# EAGLE schematic nav10_mxp_3_3_final_expio (EAGLE 6.5.0)
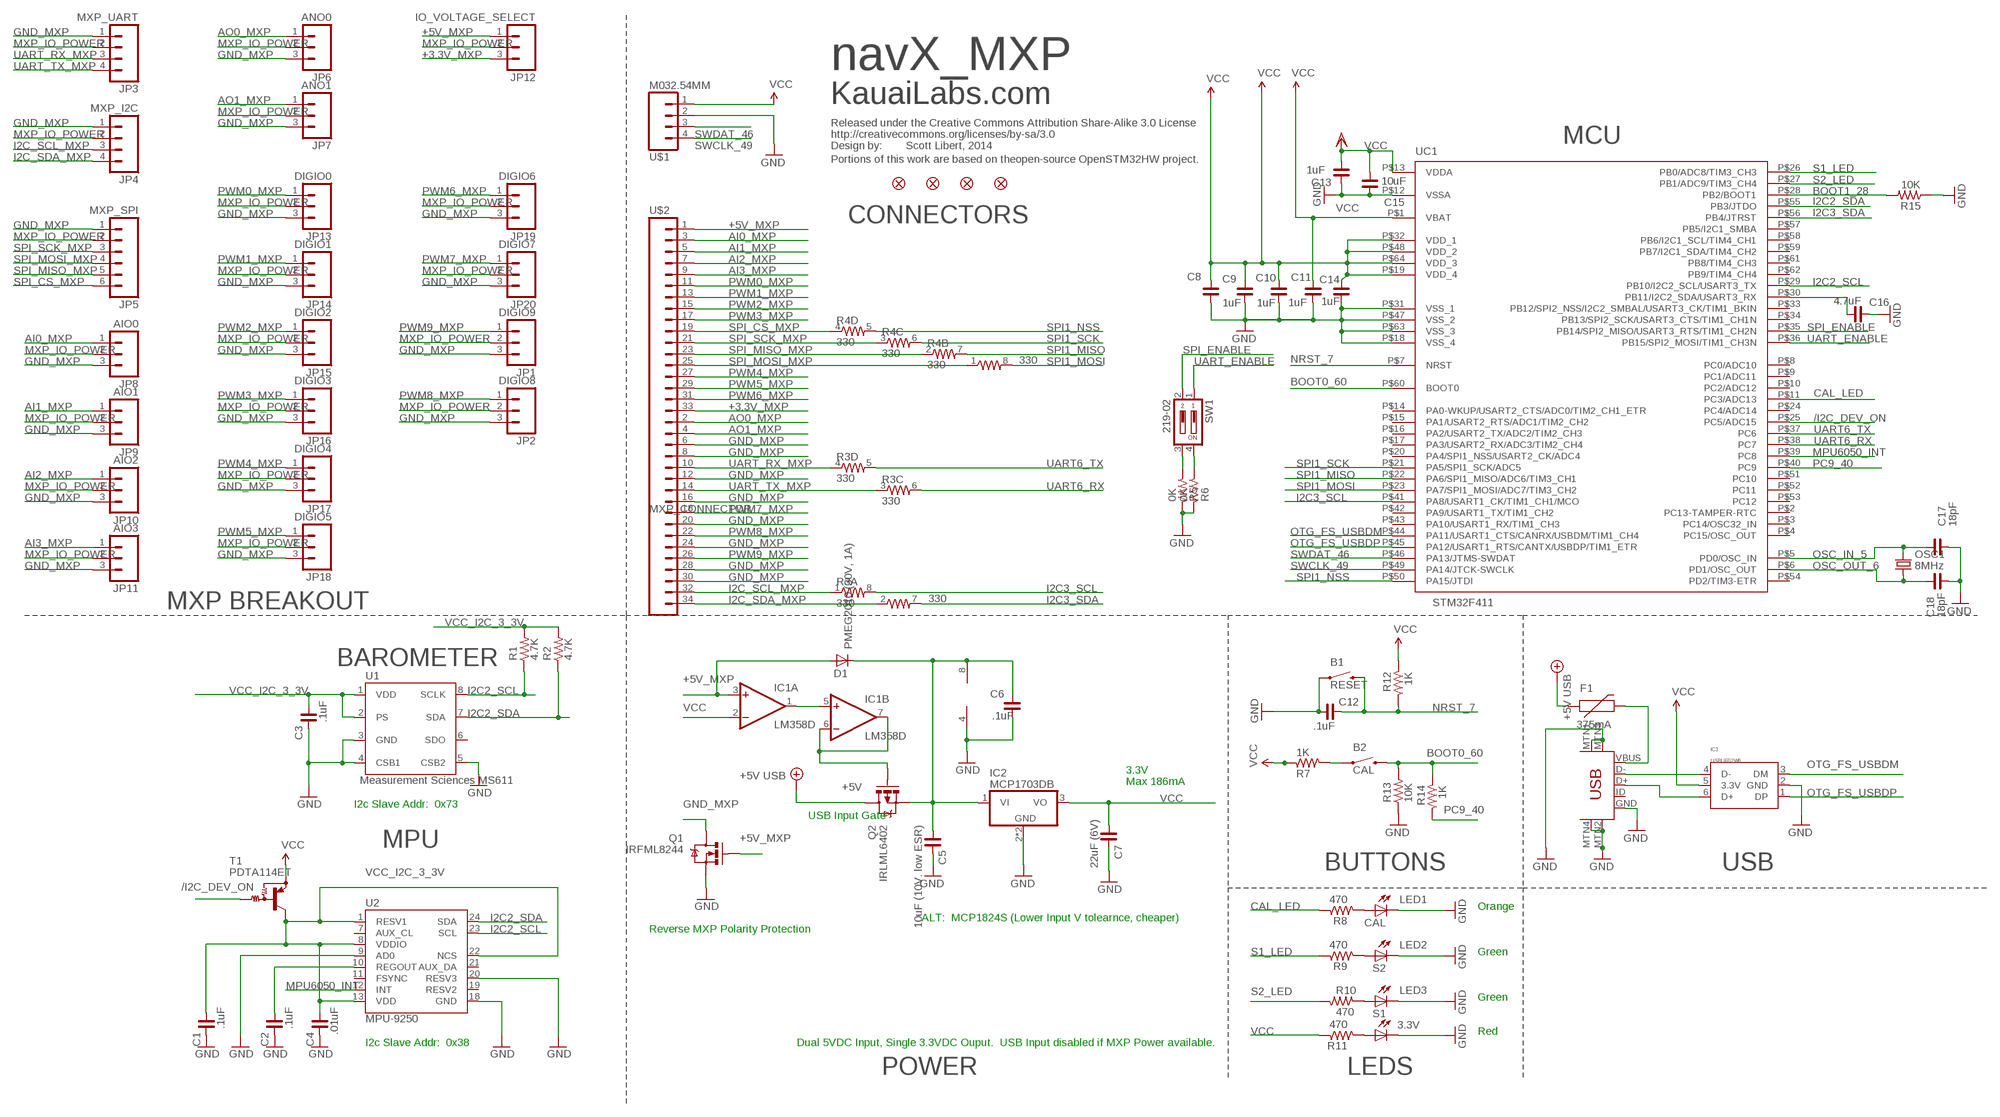
[diagram p0: schematic, sheet 1]

## Parts
B1  RESET  SWITCH-MOMENTARY-2-SMD-1101NE  [TACTILE-SWITCH-1101NE]
B2  CAL  SWITCH-MOMENTARY-2-SMD-1101NE  [TACTILE-SWITCH-1101NE]
C1  .1uF  C_0603  [C0603]
C2  .1uF  C_0603  [C0603]
C3  .1uF  C_0603  [C0603]
C4  .01uF  C_0603  [C0603]
C5  10uF (10V. low ESR)  C_0805  [C0805]
C6  .1uF  C_0603  [C0603]
C7  22uF (6V)  C_0805  [C0805]
C8  1uF  C_0603  [C0603]
C9  1uF  C_0603  [C0603]
C10  1uF  C_0603  [C0603]
C11  1uF  C_0603  [C0603]
C12  .1uF  C_0603  [C0603]
C13  1uF  C_0603  [C0603]
C14  1uF  C_0603  [C0603]
C15  10uF  C_0805  [C0805]
C16  4.7uF  C_0603  [C0603]
C17  18pF  C_0603  [C0603]
C18  18pF  C_0603  [C0603]
D1  PMEG2010 (30V, 1A)  DIODESOD-323  [SOD-323]
F1  375mA  PTC0603  [0603]
IC1  LM358D  [SO08]
IC2  MCP1703DB  [MCP1703DB]
IC3  USBUF02W6  [SC70-6]
JP1  DIGIO9  M03PTH  [1X03]
JP2  DIGIO8  M03PTH  [1X03]
JP3  MXP_UART  M04PTH  [1X04]
JP4  MXP_I2C  M04PTH  [1X04]
JP5  MXP_SPI  M06SIP  [1X06]
JP6  ANO0  M03PTH  [1X03]
JP7  ANO1  M03PTH  [1X03]
JP8  AIO0  M03PTH  [1X03]
JP9  AIO1  M03PTH  [1X03]
JP10  AIO2  M03PTH  [1X03]
JP11  AIO3  M03PTH  [1X03]
JP12  IO_VOLTAGE_SELECT  M03PTH  [1X03]
JP13  DIGIO0  M03PTH  [1X03]
JP14  DIGIO1  M03PTH  [1X03]
JP15  DIGIO2  M03PTH  [1X03]
JP16  DIGIO3  M03PTH  [1X03]
JP17  DIGIO4  M03PTH  [1X03]
JP18  DIGIO5  M03PTH  [1X03]
JP19  DIGIO6  M03PTH  [1X03]
JP20  DIGIO7  M03PTH  [1X03]
JP21  FIDUCIAL1X2  [FIDUCIAL-1X2]
JP22  FIDUCIAL1X2  [FIDUCIAL-1X2]
JP23  FIDUCIAL1X2  [FIDUCIAL-1X2]
JP24  FIDUCIAL1X2  [FIDUCIAL-1X2]
LED1  CAL  LEDCHIP-LED0603  [CHIP-LED0603]
LED2  S2  LEDCHIP-LED0603  [CHIP-LED0603]
LED3  S1  LEDCHIP-LED0603  [CHIP-LED0603]
LED4  3.3V  LEDCHIP-LED0603  [CHIP-LED0603]
LICENSE_TEXT  CREATIVE_COMMONS  [CREATIVE_COMMONS]
OSC1  8MHz  CRYSTAL5X3  [CRYSTAL-SMD-5X3]
Q1  IRFML8244  MOSFET-NCHANNELBSS123LT1G  [SOT23]
Q2  IRLML6402  MOSFET-PCHANNELSMD  [SOT23-3]
R1  4.7K  R_0603  [R0603]
R2  4.7K  R_0603  [R0603]
R3  330  RESISTOR-ARRAY0603-ARV  [0603_ARV]
R4  330  RESISTOR-ARRAY0603-ARV  [0603_ARV]
R5  0K  R_0603  [R0603]
R6  0K  R_0603  [R0603]
R7  1K  R_0603  [R0603]
R8  470  R_0603  [R0603]
R9  470  R_0603  [R0603]
R10  470  R_0603  [R0603]
R11  470  R_0603  [R0603]
R12  1K  R_0603  [R0603]
R13  10K  R_0603  [R0603]
R14  1K  R_0603  [R0603]
R15  10K  R_0603  [R0603]
SW1  219-02  [CTS-219-02]
T1  PDTA114ET  PNP-DRIVERSOT23-3  [SOT23-3]
U1  Measurement Sciences MS611  MS5611  [MS5611]
U2  MPU-9250  [QFN24_3MM_INVENSENSE]
U$1  M032.54MM  M041X04_NO_SILK  [1X04_NO_SILK]
U$2  MXP_CONNECTOR  [2X17]
UC1  STM32F411  STM32F103  [TQFP-10X10-64]
USB  Mini-USB  USB-MINIB-5PIN  [USB-MINIB]

## Nets
+3.3V_MXP: JP12.3 U$2.33(+3.3V)
+5V [vcc]: F1.1 Q2.3(D) ; supply symbol labelled +5V USB
+5V_MXP: D1.A IC1.3(A:+IN) JP12.1 Q1.1(G) U$2.1(+5V)
/I2C_DEV_ON: T1.1(B) UC1.P$25(PC5/ADC15)
AI0_MXP: JP8.1 U$2.3(AI0)
AI1_MXP: JP9.1 U$2.5(AI1)
AI2_MXP: JP10.1 U$2.7(AI2)
AI3_MXP: JP11.1 U$2.9(AI3)
AO0_MXP: JP6.1 U$2.2(AO0)
AO1_MXP: JP7.1 U$2.4(AO1)
BOOT0_60: B2.P$2 R13.2 R14.1 UC1.P$60(BOOT0)
BOOT1_28: R15.2 UC1.P$28(PB2/BOOT1)
CAL_LED: R8.1 UC1.P$11(PC3/ADC13)
GND: B1.P$1 C1.2 C2.2 C3.2 C4.2 C5.2 C6.1 C7.2 C8.1 C9.1 C10.1 C11.1 C12.1 C13.1 C14.1 C15.2 C16.1 C17.1 C18.1 IC1.4(P:V-) IC2.2(GND) IC2.4(GND) IC3.2(GND) LED1.C LED2.C LED3.C LED4.C Q1.2(S) R5.1 R6.1 R13.1 R15.1 U1.3(GND) U1.4(CSB1) U1.5(CSB2) U2.9(AD0) U2.18(GND) U2.20(RESV3) U$1.2 UC1.P$12(VSSA) UC1.P$18(VSS_4) UC1.P$31(VSS_1) UC1.P$47(VSS_2) UC1.P$63(VSS_3) USB.GND USB.MTN1(MTN2) USB.MTN2(MTN3) USB.MTN3(MTN1) USB.MTN4
GND_MXP: JP1.3 JP2.3 JP3.1 JP4.1 JP5.1 JP6.3 JP7.3 JP8.3 JP9.3 JP10.3 JP11.3 JP13.3 JP14.3 JP15.3 JP16.3 JP17.3 JP18.3 JP19.3 JP20.3 Q1.3(D) U$2.6(GND1) U$2.8(GND2) U$2.12(GND3) U$2.16(GND4) U$2.20(GND5) U$2.24(GND6) U$2.28(GND7) U$2.30(GND8)
I2C2_SCL: R1.1 U1.8(SCLK) U2.23(SCL) UC1.P$29(PB10/I2C2_SCL/USART3_TX)
I2C2_SDA: R2.1 U1.7(SDA) U2.24(SDA) UC1.P$55(PB3/JTDO)
I2C3_SCL: R3.8 UC1.P$41(PA8/USART1_CK/TIM1_CH1/MCO)
I2C3_SDA: R3.7 UC1.P$56(PB4/JTRST)
I2C_SCL_MXP: JP4.3 R3.1 U$2.32(DIO14/I2C_SCL)
I2C_SDA_MXP: JP4.4 R3.2 U$2.34(DIO15/I2C_SDA)
MPU6050_INT: U2.12(INT) UC1.P$39(PC8)
MXP_IO_POWER: JP1.2 JP2.2 JP3.2 JP4.2 JP5.2 JP6.2 JP7.2 JP8.2 JP9.2 JP10.2 JP11.2 JP12.2 JP13.2 JP14.2 JP15.2 JP16.2 JP17.2 JP18.2 JP19.2 JP20.2
N$1: C2.1 U2.10(REGOUT)
N$2: B2.P$1 R7.2
N$3: LED3.A R10.1
N$4: C16.2 UC1.P$30(PB11/I2C2_SDA/USART3_RX)
N$5: LED2.A R9.2
N$6: R6.2 SW1.4
N$7: C5.1 C6.2 D1.C IC1.8(P:V+) IC2.1(VI) Q2.2(S)
N$8: R5.2 SW1.3
N$9: IC1.1(A:OUT) IC1.5(B:+IN)
N$10: IC1.6(B:-IN) IC1.7(B:OUT) Q2.1(G)
N$11: LED1.A R8.2
N$14: IC3.4(D-) USB.D-
N$17: IC3.6(D+) USB.D+
N$18: LED4.A R11.2
N$54 [vcc]: F1.2 USB.VBUS
NRST_7: B1.P$2 C12.2 R12.2 UC1.P$7(NRST)
OSC_IN_5: C17.2 OSC1.3 UC1.P$5(PD0/OSC_IN)
OSC_OUT_6: C18.2 OSC1.1 UC1.P$6(PD1/OSC_OUT)
OTG_FS_USBDM: IC3.3(DM) UC1.P$44(PA11/USART1_CTS/CANRX/USBDM/TIM1_CH4)
OTG_FS_USBDP: IC3.1(DP) UC1.P$45(PA12/USART1_RTS/CANTX/USBDP/TIM1_ETR)
PC9_40: R14.2 UC1.P$40(PC9)
PWM0_MXP: JP13.1 U$2.11(DIO0/PWM0)
PWM1_MXP: JP14.1 U$2.13(DIO1/PWM1)
PWM2_MXP: JP15.1 U$2.15(DIO2/PWM2)
PWM3_MXP: JP16.1 U$2.17(DIO3/PWM3)
PWM4_MXP: JP17.1 U$2.27(DIO8/PWM4)
PWM5_MXP: JP18.1 U$2.29(DIO9/PWM5)
PWM6_MXP: JP19.1 U$2.31(DIO10/PWM6)
PWM7_MXP: JP20.1 U$2.18(DIO11/PWM11)
PWM8_MXP: JP2.1 U$2.22(DIO12/PWM12)
PWM9_MXP: JP1.1 U$2.26(DIO13/PWM13)
S1_LED: R9.1 UC1.P$26(PB0/ADC8/TIM3_CH3)
S2_LED: R10.2 UC1.P$27(PB1/ADC9/TIM3_CH4)
SPI1_MISO: R4.7 UC1.P$22(PA6/SPI1_MISO/ADC6/TIM3_CH1)
SPI1_MOSI: R4.8 UC1.P$23(PA7/SPI1_MOSI/ADC7/TIM3_CH2)
SPI1_NSS: R4.5 UC1.P$50(PA15/JTDI)
SPI1_SCK: R4.6 UC1.P$21(PA5/SPI1_SCK/ADC5)
SPI_CS_MXP: JP5.6 R4.4 U$2.19(DIO4/SPICS)
SPI_ENABLE: SW1.2 UC1.P$35(PB14/SPI2_MISO/USART3_RTS/TIM1_CH2N)
SPI_MISO_MXP: JP5.5 R4.2 U$2.23(DIO6/SPIMISO)
SPI_MOSI_MXP: JP5.4 R4.1 U$2.25(DIO7/SPIMOSI)
SPI_SCK_MXP: JP5.3 R4.3 U$2.21(DIO5/SPICLK)
SWCLK_49: U$1.4 UC1.P$49(PA14/JTCK-SWCLK)
SWDAT_46: U$1.3 UC1.P$46(PA13/JTMS-SWDAT)
UART6_RX: R3.6 UC1.P$38(PC7)
UART6_TX: R3.5 UC1.P$37(PC6)
UART_ENABLE: SW1.1 UC1.P$36(PB15/SPI2_MOSI/TIM1_CH3N)
UART_RX_MXP: JP3.3 R3.4 U$2.10(UART.RX)
UART_TX_MXP: JP3.4 R3.3 U$2.14(UART.TX)
VCC [vcc]: C7.1 C8.2 C9.2 C10.2 C11.2 C13.2 C14.2 C15.1 IC1.2(A:-IN) IC2.3(VO) IC3.5(3.3V) R7.1 R11.1 R12.1 T1.2(E) U$1.1 UC1.P$1(VBAT) UC1.P$13(VDDA) UC1.P$19(VDD_4) UC1.P$32(VDD_1) UC1.P$48(VDD_2) UC1.P$64(VDD_3) ; supply symbol labelled VDD
VCC_I2C_3_3V [vcc]: C1.1 C3.1 C4.1 R1.2 R2.2 T1.3(C) U1.1(VDD) U1.2(PS) U2.1(RESV1) U2.8(VDDIO) U2.13(VDD) U2.22(NCS)
Unconnected: U1.6(SDO) U2.7(AUX_CL) U2.11(FSYNC) U2.19(RESV2) U2.21(AUX_DA) UC1.P$2(PC13-TAMPER-RTC) UC1.P$3(PC14/OSC32_IN) UC1.P$4(PC15/OSC_OUT) UC1.P$8(PC0/ADC10) UC1.P$9(PC1/ADC11) UC1.P$10(PC2/ADC12) UC1.P$14(PA0-WKUP/USART2_CTS/ADC0/TIM2_CH1_ETR) UC1.P$15(PA1/USART2_RTS/ADC1/TIM2_CH2) UC1.P$16(PA2/USART2_TX/ADC2/TIM2_CH3) UC1.P$17(PA3/USART2_RX/ADC3/TIM2_CH4) UC1.P$20(PA4/SPI1_NSS/USART2_CK/ADC4) UC1.P$24(PC4/ADC14) UC1.P$33(PB12/SPI2_NSS/I2C2_SMBAL/USART3_CK/TIM1_BKIN) UC1.P$34(PB13/SPI2_SCK/USART3_CTS/TIM1_CH1N) UC1.P$42(PA9/USART1_TX/TIM1_CH2) UC1.P$43(PA10/USART1_RX/TIM1_CH3) UC1.P$51(PC10) UC1.P$52(PC11) UC1.P$53(PC12) UC1.P$54(PD2/TIM3-ETR) UC1.P$57(PB5/I2C1_SMBA) UC1.P$58(PB6/I2C1_SCL/TIM4_CH1) UC1.P$59(PB7/I2C1_SDA/TIM4_CH2) UC1.P$61(PB8/TIM4_CH3) UC1.P$62(PB9/TIM4_CH4) USB.ID

## Notes on the sheet
- navX_MXP
- KauaiLabs.com
- MCU
- Scott Libert, 2014
- Portions of this work are based on theopen-source OpenSTM32HW project.
- CONNECTORS
- MXP BREAKOUT
- BAROMETER
- 3.3V
- Max 186mA
- I2c Slave Addr:  0x73
- USB Input Gate
- MPU
- BUTTONS | USB
- Orange
- ALT:  MCP1824S (Lower Input V tolearnce, cheaper)
- Reverse MXP Polarity Protection
- Green
- Green
- Red
- I2c Slave Addr:  0x38 | Dual 5VDC Input, Single 3.3VDC Ouput.  USB Input disabled if MXP Power available.
- POWER | LEDS

## Library data of the parts
B1 B2 = SparkFun_20110922_my:SWITCH-MOMENTARY-2
C1 C2 C4 C6 C9-C18 = rc-master-smd:C_: NON-POLARIZED CAP
C3 = rc-master-smd:C_: NON-POLARIZED CAP; DIGIKEY_PART_NUMBER: 399-1096-1-ND
C5 C7 = rc-master-smd:C_: NON-POLARIZED CAP; DIGIKEY_PART_NUMBER: 399-1158-1-ND
C8 = rc-master-smd:C_: NON-POLARIZED CAP; DIGIKEY_PART_NUMBER: 399-3118-1-ND
D1 = adafruit:DIODE: Diode SMADIODE - SMA Surface Mount Package 20V 1A Schottky Diode Digikey: 641-1014-6-ND DO-1N4148 - Through Hole Small Current Diode SOD-123 20V 1 A (.5mV Vf) Schottky Diode - Digikey: MBRX120TPMSCT-ND SOD-323 10V 570mA (.38mV Vf, 3ns) Schottky Diode - Digikey: ZLLS410CT-ND SOD-523 30V 30mA Schottky Diode (RB751S-40TE61) - Digikey: RB751S-40TE61CT-ND SOT23-R/W - SOT23 Package (R = Solder Paste/Reflow Ovens, W = Hand-Soldering) BAT54Film 40V 300mA - Digikey: 497-7162-1-ND
F1 = SparkFun:PTC: Resettable Fuse PTC Resettable Fuse. Spark Fun Electronics SKU : COM-08357
IC1 = linear:LM358: OP AMP also LM158; LM258; LM2904 Source: http://cache.national.com/ds/LM/LM158.pdf
IC2 = KauaiFusionLabs:MCP1703DB; DIGIKEY_PART_NUMBER: MCP1703T-3302E/DBCT-ND
IC3 = es:USBUF; DIGIKEY_PART_NUMBER: 497-3743-1-ND
JP1 JP2 JP6-JP20 = SparkFun-Connectors:M03: Header 3 Standard 3-pin 0.1" header. Use with straight break away headers (SKU : PRT-00116), right angle break away headers (PRT-00553), swiss pins (PRT-00743), machine pins (PRT-00117), and female headers (PRT-00115). Molex polarized connector foot print use with SKU : PRT-08232 with associated crimp pins and housings.
JP3 JP4 U$1 = SparkFun-Connectors:M04: Header 4 Standard 4-pin 0.1" header. Use with straight break away headers (SKU : PRT-00116), right angle break away headers (PRT-00553), swiss pins (PRT-00743), machine pins (PRT-00117), and female headers (PRT-00115). Molex polarized connector foot print use with SKU : PRT-08231 with associated crimp pins and housings. 1MM SMD Version SKU: PRT-10208
JP5 = SparkFun-Connectors:M06: Header 6 Standard 6-pin 0.1" header. Use with straight break away headers (SKU : PRT-00116), right angle break away headers (PRT-00553), swiss pins (PRT-00743), machine pins (PRT-00117), and female headers (PRT-00115). Molex polarized connector foot print use with SKU : PRT-08094 with associated crimp pins and housings. NOTES ON THE VARIANTS LOCK and LOCK_LONGPADS... This footprint was designed to help hold the alignment of a through-hole component (i.e. 6-pin header) while soldering it into place. You may notice that each hole has been shifted either up or down by 0.005 of an inch from it's more standard position (which is a perfectly straight line). This slight alteration caused the pins (the squares in the middle) to touch the edges of the holes. Because they are alternating, it causes a "brace" to hold the component in place. 0.005 has proven to be the perfect amount of "off-center" position when using our standard breakaway headers. Although looks a little odd when you look at the bare footprint, once you have a header in there, the alteration is very hard to notice. Also, if you push a header all the way into place, it is covered up entirely on the bottom side. This idea of altering the position of holes to aid alignment will be further integrated into the Sparkfun Library for other footprints. It can help hold any component with 3 or more connection pins.
JP21-JP24 = SparkFun-Aesthetics:FIDUCIAL: Fiducial Alignment Points Various fiducial points for machine vision alignment.
LED1-LED4 = led:LED: LED OSRAM: - CHIPLED LG R971, LG N971, LY N971, LG Q971, LY Q971, LO R971, LY R971 LH N974, LH R974 LS Q976, LO Q976, LY Q976 LO Q996 - Hyper CHIPLED LW Q18S LB Q993, LB Q99A, LB R99A - SideLED LS A670, LO A670, LY A670, LG A670, LP A670 LB A673, LV A673, LT A673, LW A673 LH A674 LY A675 LS A676, LA A676, LO A676, LY A676, LW A676 LS A679, LY A679, LG A679 - Hyper Micro SIDELED® LS Y876, LA Y876, LO Y876, LY Y876 LT Y87S - SmartLED LW L88C, LW L88S LB L89C, LB L89S, LG L890 LS L89K, LO L89K, LY L89K LS L896, LA L896, LO L896, LY L896 - TOPLED LS T670, LO T670, LY T670, LG T670, LP T670 LSG T670, LSP T670, LSY T670, LOP T670, LYG T670 LG T671, LOG T671, LSG T671 LB T673, LV T673, LT T673, LW T673 LH T674 LS T676, LA T676, LO T676, LY T676, LB T676, LH T676, LSB T676, LW T676 LB T67C, LV T67C, LT T67C, LS T67K, LO T67K, LY T67K, LW E67C LS E67B, LA E67B, LO E67B, LY E67B, LB E67C, LV E67C, LT E67C LW T67C LS T679, LY T679, LG T679 LS T770, LO T770, LY T770, LG T770, LP T770 LB T773, LV T773, LT T773, LW T773 LH T774 LS E675, LA E675, LY E675, LS T675 LS T776, LA T776, LO T776, LY T776, LB T776 LHGB T686 LT T68C, LB T68C - Hyper Mini TOPLED® LB M676 - Mini TOPLED Santana® LG M470 LS M47K, LO M47K, LY M47K Source: http://www.osram.convergy.de LUXEON: - LUMILED® LXK2-PW12-R00, LXK2-PW12-S00, LXK2-PW14-U00, LXK2-PW14-V00 LXK2-PM12-R00, LXK2-PM12-S00, LXK2-PM14-U00 LXK2-PE12-Q00, LXK2-PE12-R00, LXK2-PE12-S00, LXK2-PE14-T00, LXK2-PE14-U00 LXK2-PB12-K00, LXK2-PB12-L00, LXK2-PB12-M00, LXK2-PB14-N00, LXK2-PB14-P00, LXK2-PB14-Q00 LXK2-PR12-L00, LXK2-PR12-M00, LXK2-PR14-Q00, LXK2-PR14-R00 LXK2-PD12-Q00, LXK2-PD12-R00, LXK2-PD12-S00 LXK2-PH12-R00, LXK2-PH12-S00 LXK2-PL12-P00, LXK2-PL12-Q00, LXK2-PL12-R00 Source: www.luxeon.com KINGBRIGHT: KA-3528ASYC Source: www.kingbright.com
LICENSE_TEXT = SparkFun:CREATIVE_COMMONS
OSC1 = SparkFun:CRYSTAL: Crystals Various standard crystals. Proven footprints. Spark Fun Electronics SKU : COM-00534
Q1 = SparkFun-DiscreteSemi:MOSFET-NCHANNEL: Common NMOSFET Parts MFG P/N Store ID Prod ID FDD8780 TRANS-09984 SI7820DN TRANS-11055 FDS6630A IC-08089 2N7002PW TRANS-11151 FQP30N06L COM-10213 TRANS-10060 BSS123LT1G TRANS-08345 BSS138 TRANS-00830 BS170 2N7000; DIGIKEY_PART_NUMBER: DMN3404LDICT-ND; PROD_ID: TRANS-08345
Q2 = SparkFun-DiscreteSemi:MOSFET-PCHANNEL: Generic PMOSFET
R1 R2 R5-R15 = rc-master-smd:R_: RESISTOR
R3 R4 = SparkFun-Passives:RESISTOR-ARRAY: Array Chip Resistor Source: RS Component / Phycomp; DIGIKEY_PART_NUMBER: YC164J-1.0KCT-ND
SW1 = switch-dil:219-02*: Surface Mount DIP Switch Series 219 SMT CTS Electronic Components Sourc: www.ctscorp.com; OC_FARNELL: unknown; OC_NEWARK: unknown
T1 = es:PNP-DRIVER
U1 = KauaiFusionLabs:MS5611; DIGIKEY_PART_NUMBER: MPL115A2-ND
U2 = KauaiFusionLabs:MPU-9250; DESCRIPTRION: IC MOTION PROCESSOR 24-QFN; DIGIKEY_PART_NUMBER: 1428-1019-1-ND; MANUFACTURER: INVENSENSE
U$2 = KauaiFusionLabs:MXP_CONNECTOR
UC1 = st-microelectronics:STM32F103; DIGIKEY_PART_NUMBER: 497-11154-ND
USB = SparkFun_20110922_my:USB-MINIB: Mini-USB "B" connector with 5th pin broken out. Created new symbol breaking out 5th "ID" pin in mini/micro USB connector spec. See: http://en.wikipedia.org/wiki/Mini_usb#Cables. Uses same footprint as 4-pin symbol. Also added pins to connect to mounting / shield pads if required (probably not generally needed as signals aren't shielded once they leave the connector).; DIGIKEY_PART_NUMBER: 151-1206-1-ND

## Net classes
2 RF: width 0.635 mm, clearance 0.762 mm